# EAGLE design i2c_programmer (EAGLE 6.1)
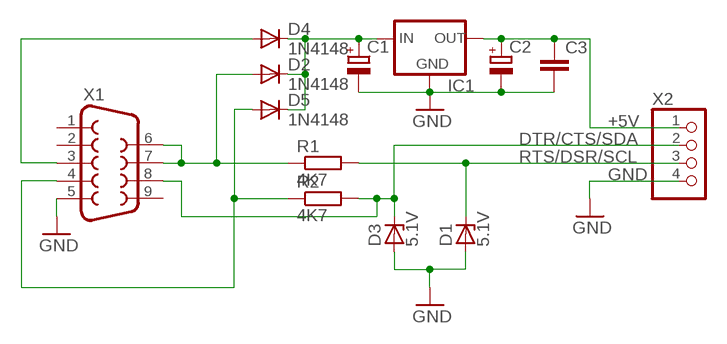
[diagram p0: schematic, sheet 1]

## Parts
C1  CPOL-EUE2.5-6  [E2,5-6]
C2  CPOL-EUE2.5-6  [E2,5-6]
C3  C-EU025-025X050  [C025-025X050]
D1  5.1V  1N4728  [DO41Z10]
D2  1N4148  1N4004A  [DO41-10]
D3  5.1V  1N4728  [DO41Z10]
D4  1N4148  1N4004A  [DO41-10]
D5  1N4148  1N4004A  [DO41-10]
IC1  78LXX  [78LXX]
R1  4K7  R-EU_0207/7  [0207/7]
R2  4K7  R-EU_0207/7  [0207/7]
X1  F09HP  [F09HP]
X2  22-23-2041  [22-23-2041]

## Nets
+5V: C2.+ C3.1 IC1.OUT X2.1
DTR: D5.A R2.1 X1.4
DTR/CTS/SDA: D3.C R2.2 X1.8 X2.2
GND: C1.- C2.- C3.2 D1.A D3.A IC1.GND X1.5 X2.4
N$6: C1.+ D2.C D4.C D5.C IC1.IN
RTS/DSR: D2.A R1.1 X1.6 X1.7
RTS/DSR/SCL: D1.C R1.2 X2.3
TXD: D4.A X1.3
Unconnected: X1.1 X1.2 X1.9

## Library data of the parts
C1 C2 = i2c:CPOL-EU: POLARIZED CAPACITOR, European symbol
C3 = i2c:C-EU: CAPACITOR, European symbol
D1 D3 = i2c:1N4728: Z DIODE 3.3 V, 1W, 5 percent
D2 D4 D5 = i2c:1N4004: DIODE general purpose rectifier, 1 A
IC1 = i2c:78LXX: VOLTAGE REGULATOR
R1 R2 = i2c:R-EU_: RESISTOR, European symbol
X1 = i2c:F09: SUB-D
X2 = i2c:22-23-2041: .100" (2.54mm) Center Header - 4 Pin

## Board
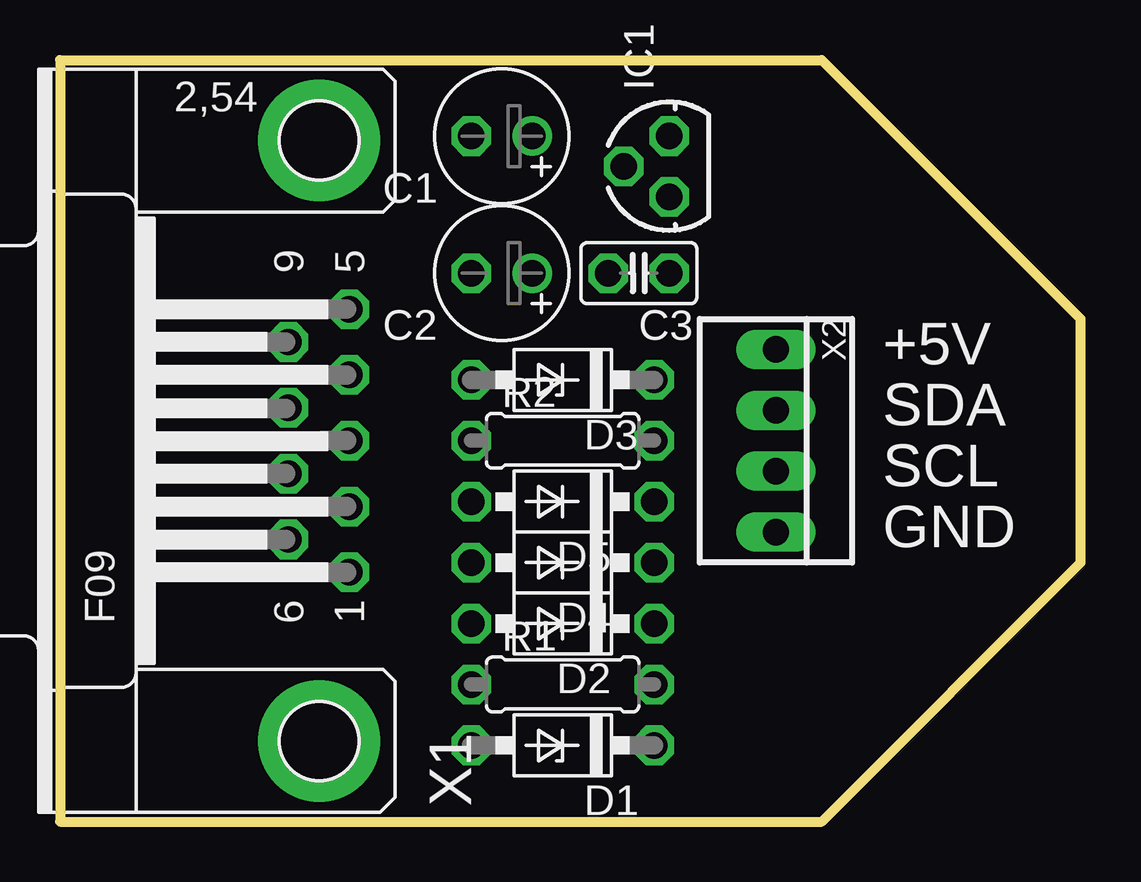
[diagram p1: board, top side]
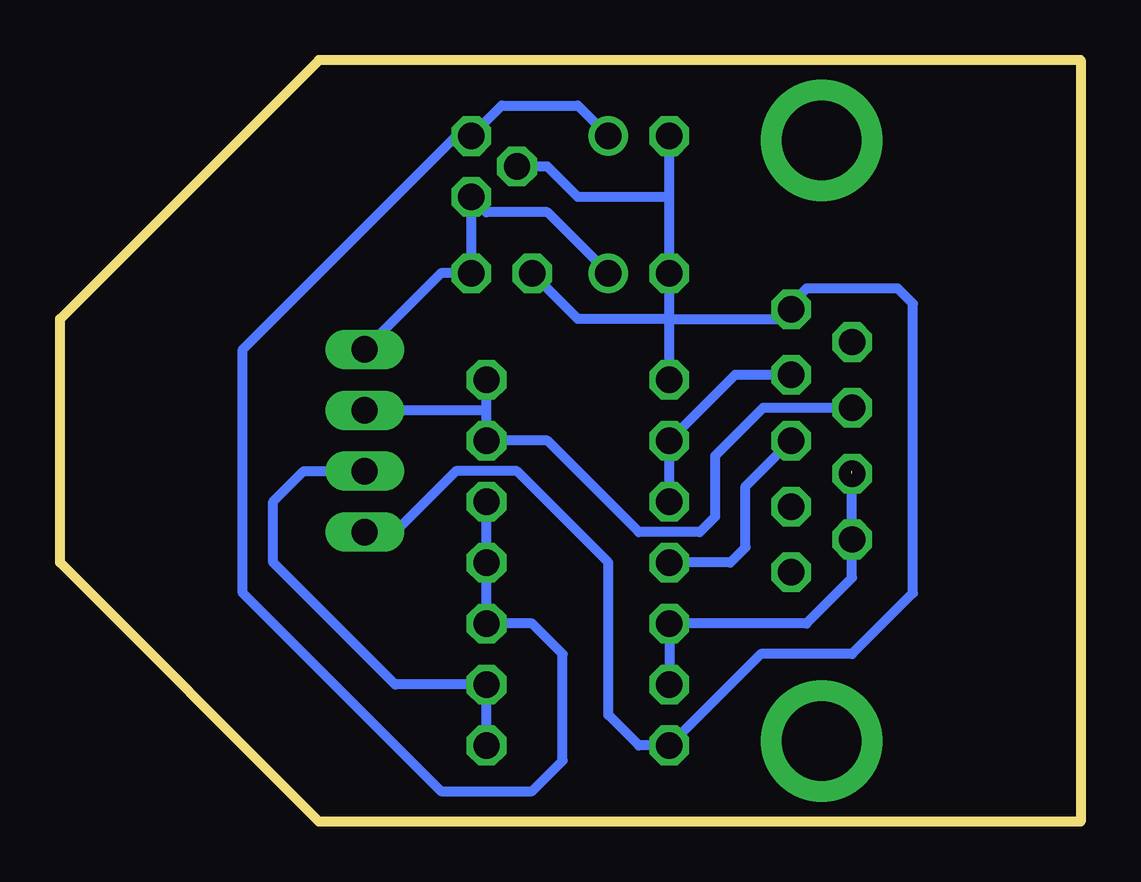
[diagram p2: board, bottom side, seen from below]

Size 42.55 x 31.75 mm. Coordinates in mm from the lower left corner, seen from the top.
Outline: 0,31.75 31.75,31.75 42.55,20.96 42.55,10.79 31.75,0 0,0 0,31.75
Copper layers (1*16): Top 0.035mm / dielectric 1.5mm / Bottom 0.035mm
Design rules: minimum track width 10mil, minimum drill 24mil, track to track 8mil, track to pad 8mil, pad to pad 8mil, via to via 8mil, smd to smd 8mil, copper to edge 40mil, drill to drill 8mil, minimum pad ring 10mil, minimum via ring 8mil, stop-mask expansion 4mil, vias tented up to drill 0mil, thermal gap 10mil

### Footprints (pad centres in the part's own frame; a part is rotated, then mirrored left to right if it is on the bottom)
E2,5-6 = drill 1.1: + -1.27,0 | drill 1.1 pad 1.6 octagon: - 1.27,0
C025-025X050 = drill 1.1 octagon: 1 -1.27,0; 2 1.27,0
DO41Z10 = drill 1.1 octagon: A 3.81,0; C -3.81,0
DO41-10 = drill 1.1 octagon: A 3.81,0; C -3.81,0
78LXX = drill 1.1 octagon: GND 0,1.905; IN 1.27,0; OUT -1.27,0
0207/7 = drill 1.1 octagon: 1 -3.81,0; 2 3.81,0
F09HP = drill 1.1 octagon: 1 -5.486,-1.27; 2 -2.743,-1.27; 3 0,-1.27; 4 2.743,-1.27; 5 5.486,-1.27; 6 -4.115,1.27; 7 -1.372,1.27; 8 1.372,1.27; 9 4.115,1.27 | drill 3.302 pad 5.08: G1 -12.522,0; G2 12.522,0
22-23-2041 = drill 1.1 long: 1 -3.81,0; 2 -1.27,0; 3 1.27,0; 4 3.81,0

### Placement (x,y rotation side)
C1  18.41,28.57 180 top
C2  18.41,22.86 180 top
C3  24.13,22.86 180 top
D1  20.95,3.18 180 top
D2  20.95,8.25 180 top
D3  20.95,18.42 180 top
D4  20.95,10.79 180 top
D5  20.95,13.34 180 top
IC1  25.4,27.3 90 top
R1  20.95,5.71 0 top
R2  20.95,15.88 0 top
X1  10.79,15.88 90 top
X2  29.84,15.88 270 top

### Tracks (layer width: path | path; a pad name or v marks a point on that pad's centre or on a via)
+5V
  Bottom 0.406: C2.+ 22.22,25.4 24.76,25.4 IC1.OUT C3.1 26.67,22.86 X2.1
DTR
  Bottom 0.406: X1.4 14.4,18.62 R2.1 D5.A
DTR/CTS/SDA
  Bottom 0.406: X1.8 13.23,17.25 15.24,15.24 15.24,12.7 15.88,12.07 18.41,12.07 22.22,15.88 R2.2 24.76,17.14 | 24.76,17.14 D3.C | 24.76,17.14 X2.2
GND
  Bottom 0.406: D3.A 17.14,20.96 | 17.14,26.04 C2.- 17.14,20.96 | 17.14,26.04 C1.- | 12.06,21.59 11.43,22.22 7.62,22.22 6.99,21.59 6.99,9.52 9.53,6.98 13.34,6.98 D1.A 18.41,3.18 19.68,4.45 19.68,10.79 23.49,14.61 26.04,14.61 28.57,12.07 X2.4 | C3.2 20.95,20.96 17.14,20.96 | IC1.GND 22.22,27.3 20.95,26.04 17.14,26.04 | 12.06,21.59 X1.5 | 17.14,20.96 12.06,20.96 12.06,21.59
N$6
  Bottom 0.406: D5.C D4.C D2.C 22.86,8.25 21.59,6.98 21.59,2.54 22.86,1.27 26.67,1.27 34.93,9.52 34.93,19.68 26.04,28.57 IC1.IN 24.13,29.85 20.95,29.85 C1.+
RTS/DSR  (1 unrouted)
  Bottom 0.406: X1.6 9.53,11.43 | X1.6 X1.7 | X1.6 9.53,10.16 11.43,8.25 D2.A R1.1
RTS/DSR/SCL
  Bottom 0.406: D1.C R1.2 28.57,5.71 33.66,10.79 33.66,13.34 32.39,14.61 X2.3
TXD
  Bottom 0.406: X1.3 13.97,13.97 13.97,11.43 14.61,10.79 D4.A

### Text on the board
tNames: +5V | SDA | SCL | GND